# EAGLE design PFC_breakout_v2b (EAGLE 7.6.0)
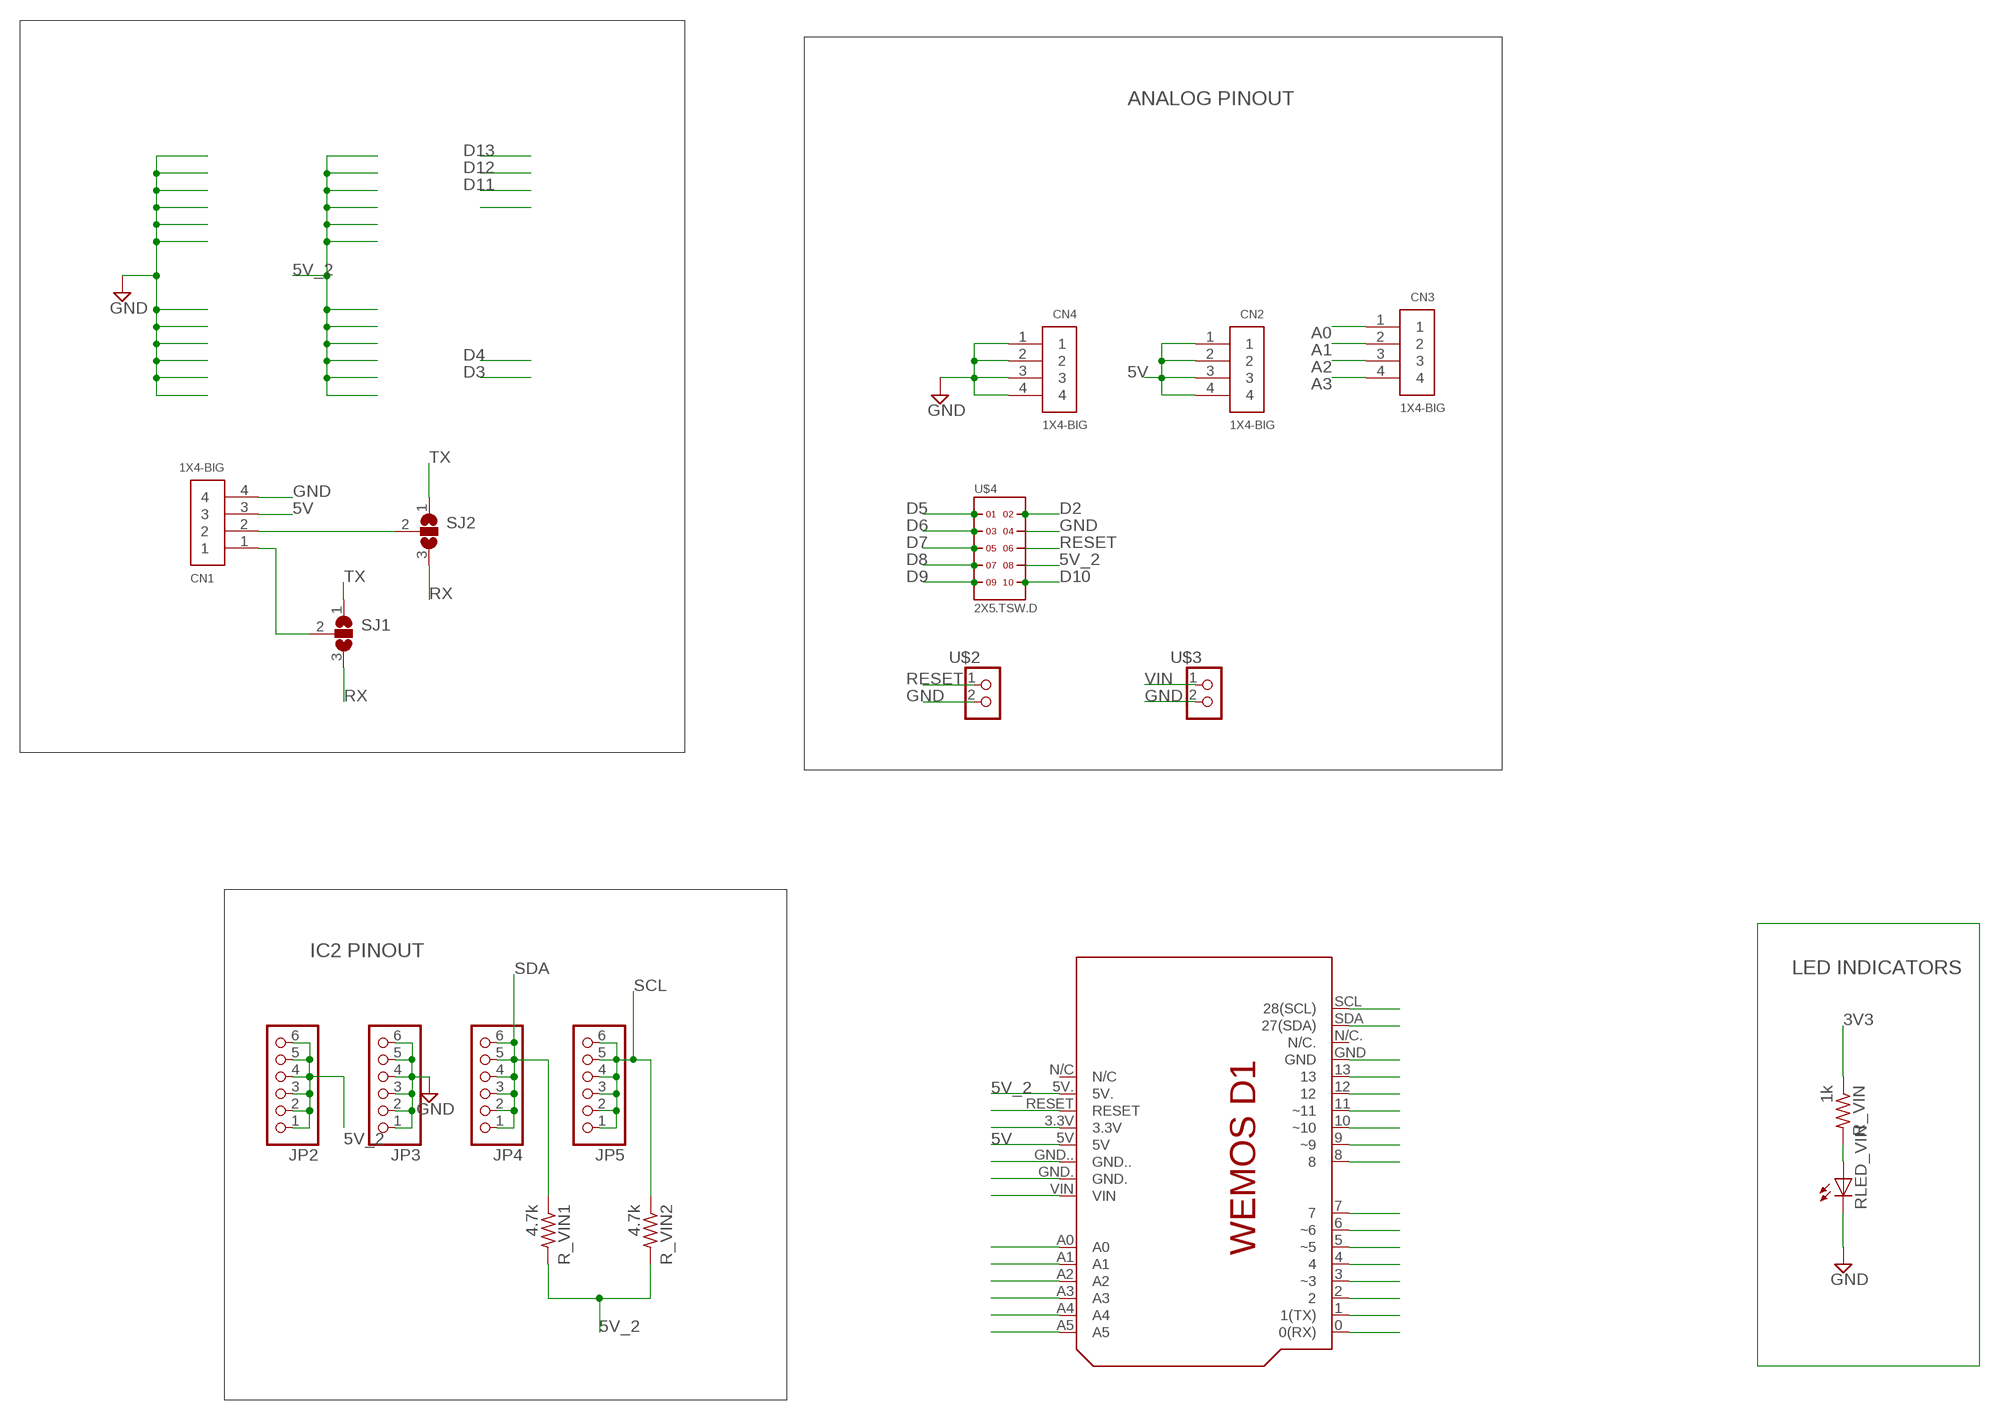
[diagram p0: schematic, sheet 1]

## Parts
CN1  1X4-BIG  [1X04-BIG]
CN2  1X4-BIG  [1X04-BIG]
CN3  1X4-BIG  [1X04-BIG]
CN4  1X4-BIG  [1X04-BIG]
JP2  PINHD-1X6  [1X06]
JP3  PINHD-1X6  [1X06]
JP4  PINHD-1X6  [1X06]
JP5  PINHD-1X6  [1X06]
R_VIN  1k  R-US_R0603  [R0603]
R_VIN1  4.7k  R-US_R0603  [R0603]
R_VIN2  4.7k  R-US_R0603  [R0603]
RLED_VIN  LEDCHIP-LED0603  [CHIP-LED0603]
SJ1  SJ2W  [SJ_2]
SJ2  SJ2W  [SJ_2]
U$1  WEMOS-D1SHIELD  [WEMOS-D1]
U$2  PINHD-2X1  [2X01]
U$3  PINHD-2X1  [2X01]
U$4  2X5.TSW.D  [TSW-105-XXX-D-XXX]

## Nets
3V3: R_VIN.1 U$1.3.3V
5V: CN1.3 CN2.1 CN2.2 CN2.3 CN2.4 U$1.5V
5V_2: JP2.1 JP2.2 JP2.3 JP2.4 JP2.5 JP2.6 R_VIN1.2 R_VIN2.2 U$1.5V. U$4.8
A0: CN3.1 U$1.A0
A1: CN3.2 U$1.A1
A2: CN3.3 U$1.A2
A3: CN3.4 U$1.A3
A4: U$1.A4
A5: U$1.A5
D2: U$1.2 U$4.2
D3: U$1.3(~3)
D4: U$1.4
D5: U$1.5(~5) U$4.1
D6: U$1.6(~6) U$4.3
D7: U$1.7 U$4.5
D8: U$1.8 U$4.7
D9: U$1.9(~9) U$4.9
D10: U$1.10(~10) U$4.10
D11: U$1.11(~11)
D12: U$1.12
D13: U$1.13
GND: CN1.4 CN4.1 CN4.2 CN4.3 CN4.4 JP3.1 JP3.2 JP3.3 JP3.4 JP3.5 JP3.6 RLED_VIN.C U$1.GND U$1.GND. U$1.GND.. U$2.2 U$3.2 U$4.4
N$1: R_VIN.2 RLED_VIN.A
N$2: CN1.2 SJ2.2
N$3: CN1.1 SJ1.2
RESET: U$1.RESET U$2.1 U$4.6
RX: SJ1.3 SJ2.3 U$1.0(0(RX))
SCL: JP5.1 JP5.2 JP5.3 JP5.4 JP5.5 JP5.6 R_VIN2.1 U$1.SCL(28(SCL))
SDA: JP4.1 JP4.2 JP4.3 JP4.4 JP4.5 JP4.6 R_VIN1.1 U$1.SDA(27(SDA))
TX: SJ1.1 SJ2.1 U$1.1(1(TX))
VIN: U$1.VIN U$3.1
Unconnected: U$1.N/C U$1.N/C.

## Notes on the sheet
- ANALOG PINOUT
- IC2 PINOUT
- LED INDICATORS

## Library data of the parts
CN1-CN4 = adafruit:1X4: 4-pin connector
JP2-JP5 = adafruit:PINHD-1X6: PIN HEADER
R_VIN R_VIN1 R_VIN2 = resistor:R-US_: RESISTOR, American symbol
RLED_VIN = led:LED: LED OSRAM: - CHIPLED LG R971, LG N971, LY N971, LG Q971, LY Q971, LO R971, LY R971 LH N974, LH R974 LS Q976, LO Q976, LY Q976 LO Q996 - Hyper CHIPLED LW Q18S LB Q993, LB Q99A, LB R99A - SideLED LS A670, LO A670, LY A670, LG A670, LP A670 LB A673, LV A673, LT A673, LW A673 LH A674 LY A675 LS A676, LA A676, LO A676, LY A676, LW A676 LS A679, LY A679, LG A679 - Hyper Micro SIDELED® LS Y876, LA Y876, LO Y876, LY Y876 LT Y87S - SmartLED LW L88C, LW L88S LB L89C, LB L89S, LG L890 LS L89K, LO L89K, LY L89K LS L896, LA L896, LO L896, LY L896 - TOPLED LS T670, LO T670, LY T670, LG T670, LP T670 LSG T670, LSP T670, LSY T670, LOP T670, LYG T670 LG T671, LOG T671, LSG T671 LB T673, LV T673, LT T673, LW T673 LH T674 LS T676, LA T676, LO T676, LY T676, LB T676, LH T676, LSB T676, LW T676 LB T67C, LV T67C, LT T67C, LS T67K, LO T67K, LY T67K, LW E67C LS E67B, LA E67B, LO E67B, LY E67B, LB E67C, LV E67C, LT E67C LW T67C LS T679, LY T679, LG T679 LS T770, LO T770, LY T770, LG T770, LP T770 LB T773, LV T773, LT T773, LW T773 LH T774 LS E675, LA E675, LY E675, LS T675 LS T776, LA T776, LO T776, LY T776, LB T776 LHGB T686 LT T68C, LB T68C - Hyper Mini TOPLED® LB M676 - Mini TOPLED Santana® LG M470 LS M47K, LO M47K, LY M47K Source: http://www.osram.convergy.de LUXEON: - LUMILED® LXK2-PW12-R00, LXK2-PW12-S00, LXK2-PW14-U00, LXK2-PW14-V00 LXK2-PM12-R00, LXK2-PM12-S00, LXK2-PM14-U00 LXK2-PE12-Q00, LXK2-PE12-R00, LXK2-PE12-S00, LXK2-PE14-T00, LXK2-PE14-U00 LXK2-PB12-K00, LXK2-PB12-L00, LXK2-PB12-M00, LXK2-PB14-N00, LXK2-PB14-P00, LXK2-PB14-Q00 LXK2-PR12-L00, LXK2-PR12-M00, LXK2-PR14-Q00, LXK2-PR14-R00 LXK2-PD12-Q00, LXK2-PD12-R00, LXK2-PD12-S00 LXK2-PH12-R00, LXK2-PH12-S00 LXK2-PL12-P00, LXK2-PL12-Q00, LXK2-PL12-R00 Source: www.luxeon.com KINGBRIGHT: KA-3528ASYC Source: www.kingbright.com
SJ1 SJ2 = jumper:SJ2W: SMD solder JUMPER
U$1 = esp8266modules:WEMOS-D1
U$2 U$3 = pinhead:PINHD-2X1
U$4 = headers(.1in)(samtec):2X5

## Board
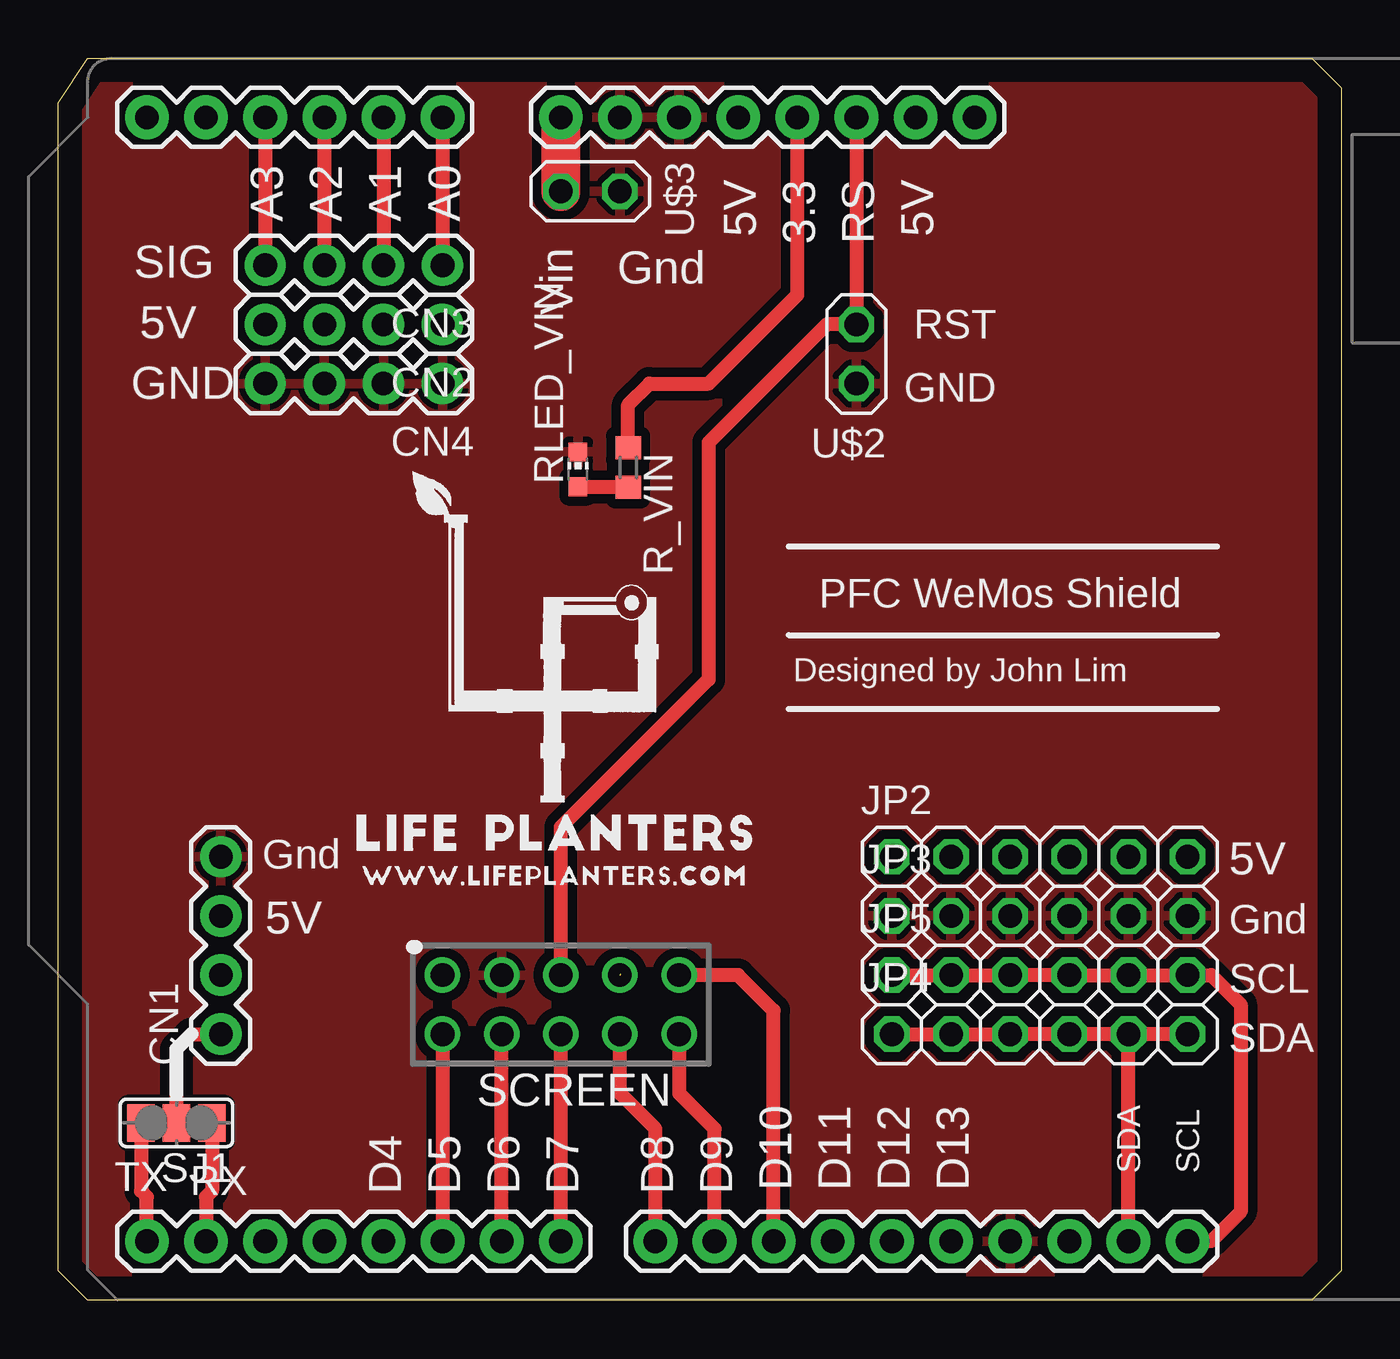
[diagram p1: board, top side]
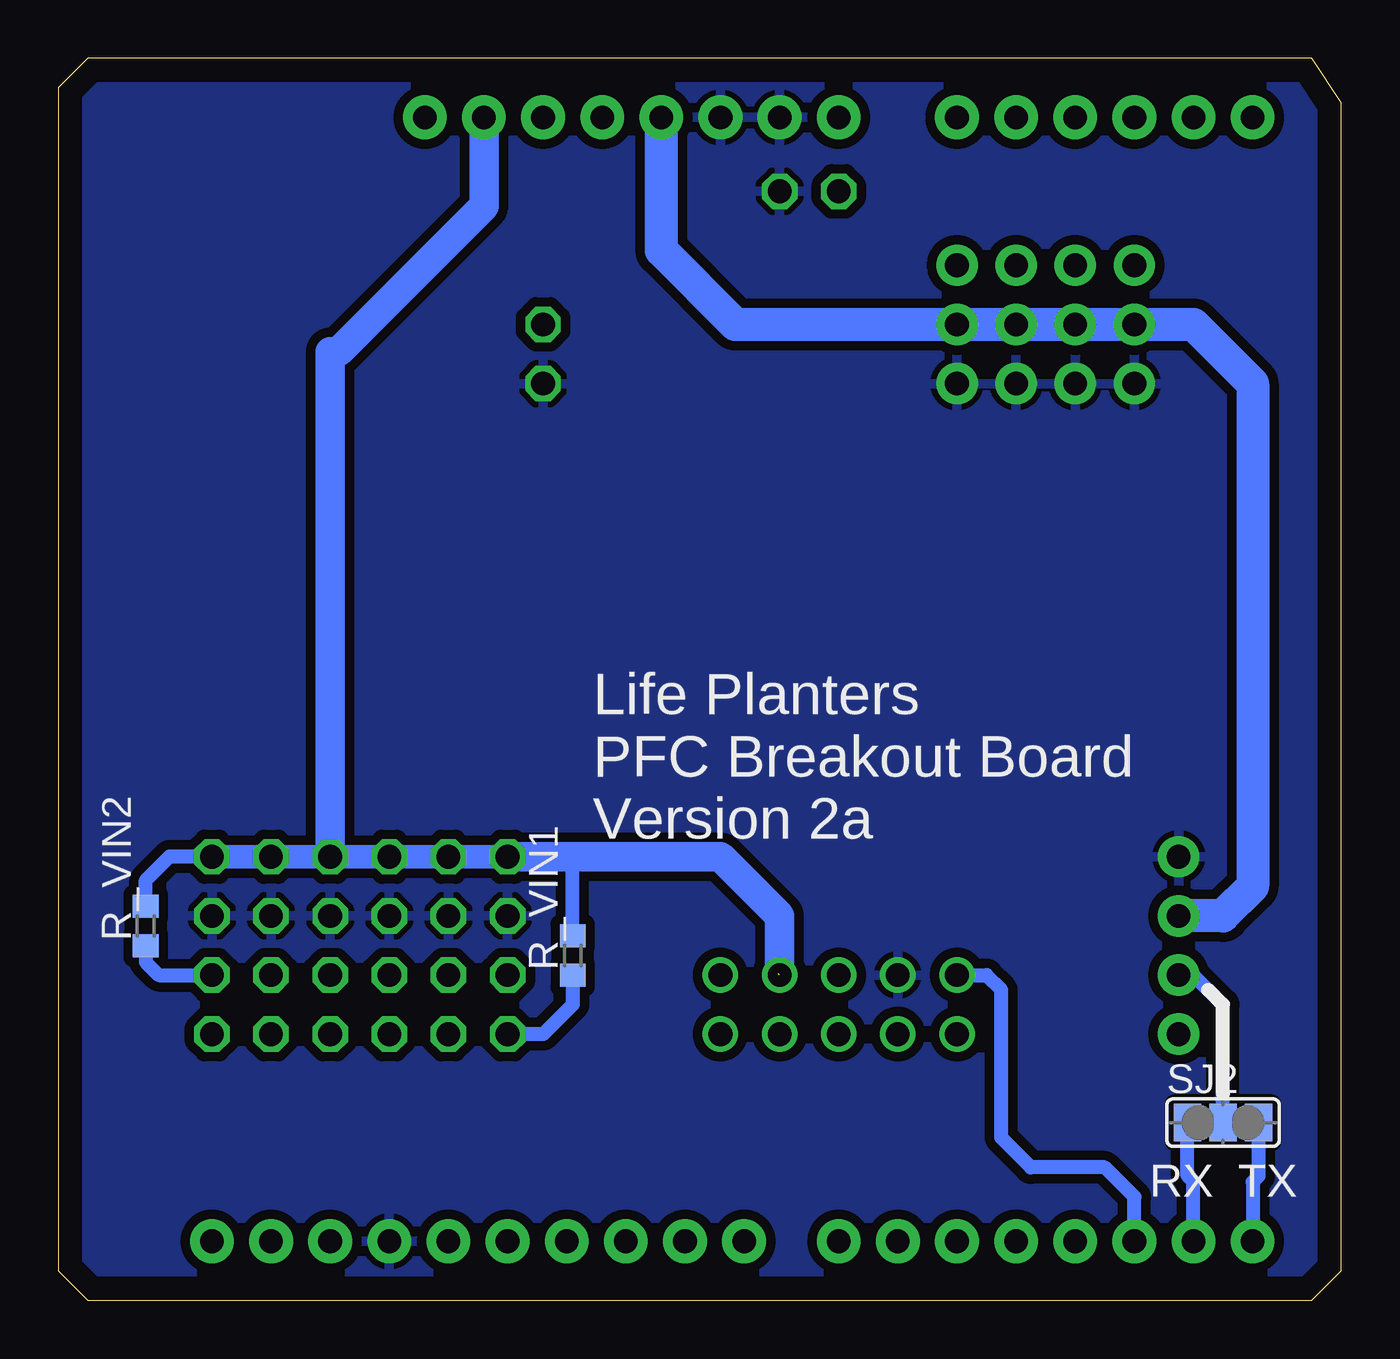
[diagram p2: board, bottom side, seen from below]

Size 55.12 x 53.34 mm. Coordinates in mm from the lower left corner, seen from the top.
Outline: 1.27,53.34 53.85,53.34 55.12,52.07 55.12,1.27 53.85,0 1.27,0 0,1.27 0,51.44 1.27,53.34
Copper layers (1*16): Top 0.035mm / dielectric 1.5mm / Bottom 0.035mm
Design rules "default": minimum track width 10mil, minimum drill 24mil, track to track 8mil, track to pad 8mil, pad to pad 8mil, via to via 8mil, smd to smd 8mil, copper to edge 40mil, drill to drill 8mil, minimum pad ring 10mil, minimum via ring 8mil, stop-mask expansion 4mil, vias tented up to drill 0mil, thermal gap 10mil

### Footprints (pad centres in the part's own frame; a part is rotated, then mirrored left to right if it is on the bottom)
1X04-BIG = drill 1.016 pad 1.778: 1 0,0; 2 2.54,0; 3 5.08,0; 4 7.62,0
1X06 = drill 1.016 octagon: 1 -6.35,0; 2 -3.81,0; 3 -1.27,0; 4 1.27,0; 5 3.81,0; 6 6.35,0
R0603 = smd 1 x 1.1: 1 -0.85,0; 2 0.85,0
CHIP-LED0603 = smd 0.8 x 0.8: A 0,-0.75; C 0,0.75
SJ_2 = smd 1.168 x 1.6: 1 -1.524,0; 2 0,0; 3 1.524,0
WEMOS-D1 = drill 1.016 pad 1.88: 0 63.5,50.8; 1 60.96,50.8; 2 58.42,50.8; 3 55.88,50.8; 3.3V 35.56,2.54; 4 53.34,50.8; 5 50.8,50.8; 5V 38.1,2.54; 5V. 30.48,2.54; 6 48.26,50.8; 7 45.72,50.8; 8 41.656,50.8; 9 39.116,50.8; 10 36.576,50.8; 11 34.036,50.8; 12 31.496,50.8; 13 28.956,50.8; A0 50.8,2.54; A1 53.34,2.54; A2 55.88,2.54; A3 58.42,2.54; A4 60.96,2.54; A5 63.5,2.54; GND 26.416,50.8; GND. 43.18,2.54; GND.. 40.64,2.54; N/C 27.94,2.54; N/C. 23.876,50.8; RESET 33.02,2.54; SCL 18.796,50.8; SDA 21.336,50.8; VIN 45.72,2.54
2X01 = drill 1.016 octagon: 1 -1.27,-1.27; 2 -1.27,1.27
TSW-105-XXX-D-XXX = drill 1.016 pad 1.524: 1 -5.08,-1.27; 2 -5.08,1.27; 3 -2.54,-1.27; 4 -2.54,1.27; 5 0,-1.27; 6 0,1.27; 7 2.54,-1.27; 8 2.54,1.27; 9 5.08,-1.27; 10 5.08,1.27

### Placement (x,y rotation side)
CN1  6.98,11.43 90 top
CN2  16.51,41.91 180 top
CN3  16.51,44.45 180 top
CN4  16.51,39.37 180 top
JP2  42.16,19.05 0 top
JP3  42.16,16.51 0 top
JP4  42.16,11.43 0 top
JP5  42.16,13.97 0 top
R_VIN  24.49,35.76 270 top
R_VIN1  33.02,14.81 90 bottom
R_VIN2  51.36,16.08 90 bottom
RLED_VIN  22.33,35.69 0 top
SJ1  5.08,7.62 180 top
SJ2  5.08,7.63 0 bottom
U$1  67.31,53.34 180 top
U$2  33.02,40.64 180 top
U$3  22.86,46.35 270 top
U$4  21.59,12.7 0 top

### Tracks (layer width: path | path; a pad name or v marks a point on that pad's centre or on a via)
3V3
  Top 0.61: R_VIN.1 24.49,38.46 25.4,39.37 27.94,39.37 31.75,43.18 U$1.3.3V
5V
  Bottom 1.422: U$1.5V 29.21,45.08 26.03,41.91 CN2.1 CN2.2 CN2.3 CN2.4 6.35,41.91 3.81,39.37 3.81,17.78 5.08,16.51 CN1.3
5V_2  (1 unrouted)
  Bottom 0.61: JP2.6 50.34,19.05 51.36,18.03 R_VIN2.2 | R_VIN1.2 33.02,19.05
  Bottom 1.016: JP2.1 JP2.2 JP2.3 JP2.4 JP2.5 JP2.6
  Bottom 1.27: U$1.5V. 36.83,46.99 43.08,40.74 43.43,40.74 JP2.4 | 24.19,14.03 24.13,14.08 24.13,16.51 26.67,19.05 33.02,19.05 JP2.1
A0
  Top 0.61: U$1.A0 CN3.1
A1
  Top 0.61: U$1.A1 CN3.2
A2
  Top 0.61: U$1.A2 CN3.3
A3
  Top 0.61: U$1.A3 CN3.4
D2
  Bottom 0.61: U$1.2 8.89,4.45 10.16,5.71 13.34,5.71 14.6,6.98 14.6,13.33 15.24,13.97 U$4.2
D5
  Top 0.61: U$4.1 U$1.5
D6
  Top 0.61: U$1.6 U$4.3
D7
  Top 0.61: U$4.5 U$1.7
D8
  Top 0.61: U$1.8 25.65,7.37 24.13,8.89 U$4.7
D9
  Top 0.61: U$1.9 28.19,7.37 26.67,8.89 U$4.9
D10
  Top 0.61: U$1.10 30.73,12.45 29.21,13.97 U$4.10
GND
  pour Bottom (isolate 0.406): 0.63,52.7 0.63,1.27 1.27,0 53.21,0 54.48,1.27 54.48,52.07 52.58,52.7
  pour Top (isolate 0.406): 0.63,52.7 0.63,1.91 1.27,0 53.21,0 54.48,1.27 54.48,52.7
N$1
  Top 0.61: R_VIN.2 22.3,34.91 RLED_VIN.A
N$2
  Bottom 0.61: SJ2.2 5.08,12.7 6.35,13.97 CN1.2
N$3
  Top 0.61: SJ1.2 5.08,10.79 5.71,11.43 CN1.1
RESET
  Top 0.61: U$1.RESET U$2.1 33.02,41.91 27.94,36.83 27.94,26.67 21.59,20.32 U$4.6
RX
  Top 0.61: U$1.0 3.81,4.45 3.56,4.7 SJ1.3
  Bottom 0.61: SJ2.3 3.56,5.33 3.81,5.08 U$1.0
SCL
  Top 0.61: JP5.1 JP5.2 JP5.3 JP5.4 JP5.5 JP5.6 49.53,13.97 50.8,12.7 50.8,3.81 49.53,2.54 U$1.SCL
  Bottom 0.61: R_VIN2.1 51.36,14.53 50.8,13.97 JP5.6
SDA
  Top 0.61: U$1.SDA JP4.5 | JP4.1 JP4.2 JP4.3 JP4.4 JP4.5 | JP4.6 JP4.5
  Bottom 0.61: R_VIN1.1 33.02,12.7 34.29,11.43 JP4.1
TX
  Top 0.61: SJ1.1 6.6,4.7 6.35,4.45 U$1.1
  Bottom 0.61: U$1.1 6.35,5.11 6.6,5.36 SJ2.1
VIN
  Top 1.676: U$1.VIN U$3.1

### Text on the board
tPlace: PFC WeMos Shield | Designed by John Lim
bPlace: Life Planters / PFC Breakout Board / Version 2a | TX | RX
tSilk: A3 | A2 | A1 | A0 | 5V | 3.3 | RS | 5V | Vin | Gnd | SIG | RST | 5V | GND | GND | Gnd | 5V | 5V | Gnd | SCL | SDA | SCREEN | D10 | D11 | D12 | D13 | D4 | D5 | D6 | D7 | D8 | D9 | SDA | SCL | TX | TX | RX